# EAGLE design BLE -- HM-10 -- Breakout v1.0 (EAGLE 7.7.0)
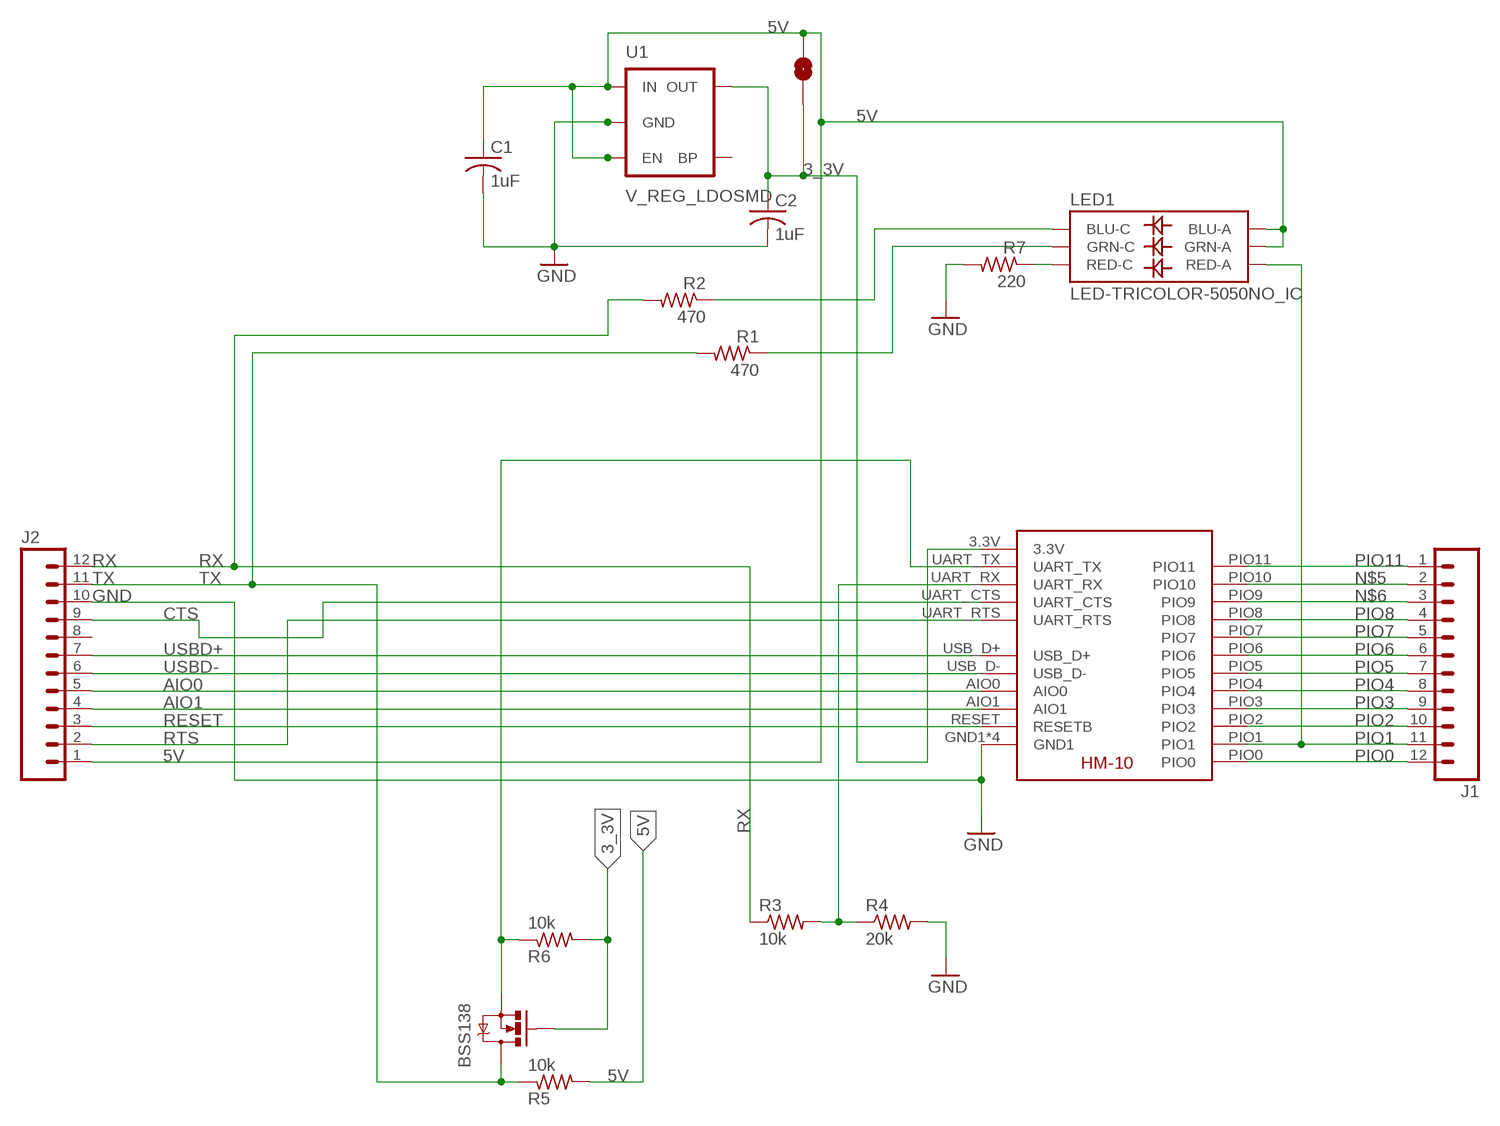
[diagram p0: schematic, sheet 1]

## Parts
BSS138  MOSFET-NCHANNELSMD  [SOT23-3]
C1  1uF  C-USC0805K  [C0805K]
C2  1uF  C-USC0805K  [C0805K]
J1  M12LOCK  [1X12_LOCK]
J2  M12LOCK  [1X12_LOCK]
LED1  LED-TRICOLOR-5050NO_IC  [LED-TRICOLOR-5050]
R1  470  R-US_M0805  [M0805]
R2  470  R-US_M0805  [M0805]
R3  10k  R-US_M0805  [M0805]
R4  20k  R-US_M0805  [M0805]
R5  10k  R-US_M0805  [M0805]
R6  10k  R-US_M0805  [M0805]
R7  220  R-US_M0805  [M0805]
SJ1  SOLDERJUMPERNO  [SJ_2S-NO]
U1  V_REG_LDOSMD  [SOT23-5]
U$1  BLE-HM-10  [BLE-HM-10]

## Nets
3_3V: BSS138.1(G) C2.1 R6.2 SJ1.1 U1.5(OUT) U$1.3.3V
5V: C1.1 J2.1 LED1.1(GRN-A) LED1.3(BLU-A) R5.2 SJ1.2 U1.1(IN) U1.3(EN)
AIO0: J2.5 U$1.AIO0
AIO1: J2.4 U$1.AIO1
CTS: J2.9 U$1.UART_CTS
GND: C1.2 C2.2 J2.10 R4.2 R7.2 U1.2(GND) U$1.GND1 U$1.GND2(GND1) U$1.GND3(GND1) U$1.GND4(GND1)
HMD_RX: R3.2 R4.1 U$1.UART_RX
N$2: LED1.5(RED-C) R7.1
N$3: LED1.4(BLU-C) R2.1
N$4: LED1.6(GRN-C) R1.1
N$5: J1.2 U$1.PIO10
N$6: J1.3 U$1.PIO9
PIO0: J1.12 U$1.PIO0
PIO1: J1.11 LED1.2(RED-A) U$1.PIO1
PIO2: J1.10 U$1.PIO2
PIO3: J1.9 U$1.PIO3
PIO4: J1.8 U$1.PIO4
PIO5: J1.7 U$1.PIO5
PIO6: J1.6 U$1.PIO6
PIO7: J1.5 U$1.PIO7
PIO8: J1.4 U$1.PIO8
PIO11: J1.1 U$1.PIO11
RESET: J2.3 U$1.RESET(RESETB)
RTS: J2.2 U$1.UART_RTS
RX: J2.12 R2.2 R3.1
TX: BSS138.2(S) BSS138.3(D) J2.11 R1.2 R5.1 R6.1 U$1.UART_TX
USBD+: J2.7 U$1.USB_D+
USBD-: J2.6 U$1.USB_D-
Unconnected: J2.8 U1.4(BP)

## Library data of the parts
BSS138 = SparkFun:MOSFET-NCHANNEL
C1 C2 = resistor:C-US: CAPACITOR, American symbol
J1 J2 = SparkFun-Connectors:M12: Header 12 Standard 12-pin 0.1" header. Use with straight break away headers (SKU : PRT-00116), right angle break away headers (PRT-00553), swiss pins (PRT-00743), machine pins (PRT-00117), and female headers (PRT-00115).
LED1 = SparkFun-LED:LED-TRICOLOR-5050; PROD_ID: DIO-10298
R1-R7 = resistor:R-US_: RESISTOR, American symbol
SJ1 = SparkFun:SOLDERJUMPER: Solder Jumper Standard SMD solder jumper. Used to automate production. Two varients : Normally Open and Normally Closed are the same, but have different paste layers. NC will have a large amount of paste and should jumper during reflow.
U1 = SparkFun:V_REG_LDO: Voltage Regulator LDO Standard 150mA LDO voltage regulator in SOT-23 layout. Micrel part MIC5205. BP (by-pass) pin is used to lower output noise with 470pF cap.
U$1 = Random parts:BLE-HM-10

## Board
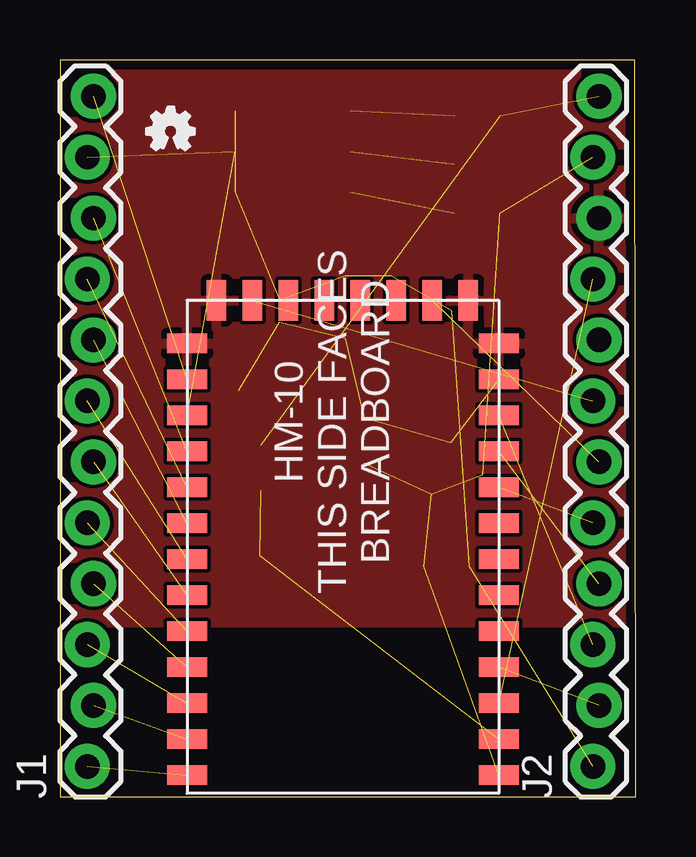
[diagram p1: board, top side]
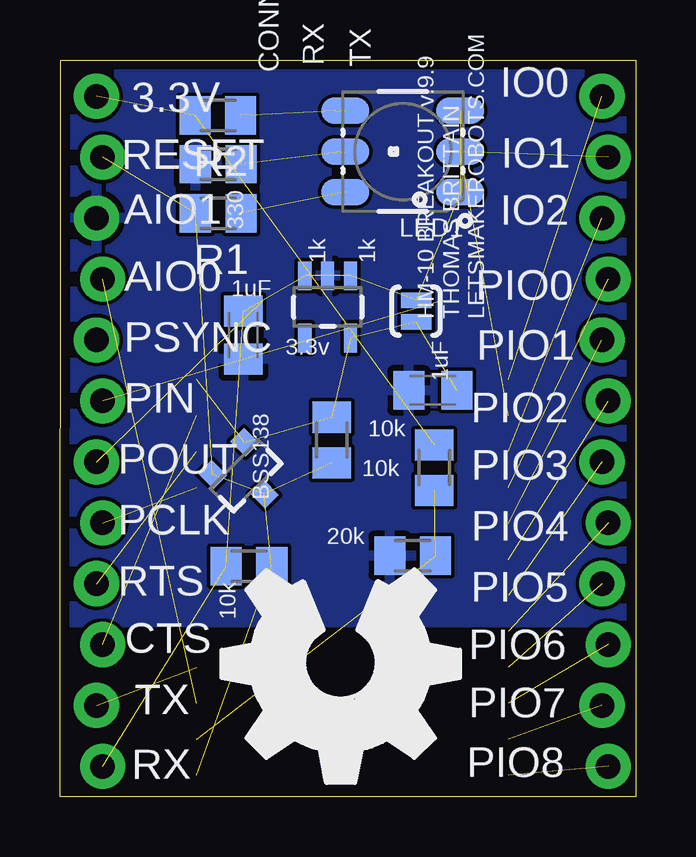
[diagram p2: board, bottom side, seen from below]

Size 24 x 30.72 mm. Coordinates in mm from the lower left corner, seen from the top.
Outline: 0,0 24,0 23.98,30.72 0,30.72 0,0
Copper layers (1*16): Top 0.0356mm / dielectric 1.5011mm / Bottom 0.0356mm
Design rules "LaenPCBOrder *": minimum track width 12mil, minimum drill 13mil, track to track 6mil, track to pad 6mil, pad to pad 6mil, via to via 6mil, smd to smd 6mil, copper to edge 15mil, drill to drill 6mil, minimum pad ring 7mil, minimum via ring 7mil, stop-mask expansion 4mil, vias tented up to drill 0.4mm, thermal gap 10mil

### Footprints (pad centres in the part's own frame; a part is rotated, then mirrored left to right if it is on the bottom)
SOT23-3 = smd 0.8 x 0.9: 1 -0.95,-1; 2 0.95,-1; 3 0,1.1
C0805K = smd 1.3 x 1.6: 1 -1,0; 2 1,0
1X12_LOCK = drill 1.016 pad 1.88: 1 0,0.127; 2 2.54,-0.127; 3 5.08,0.127; 4 7.62,-0.127; 5 10.16,0.127; 6 12.7,-0.127; 7 15.24,0.127; 8 17.78,-0.127; 9 20.32,0.127; 10 22.86,-0.127; 11 25.4,0.127; 12 27.94,-0.127
LED-TRICOLOR-5050 = smd 2 x 1.1: 1 -2.4,1.7; 2 -2.4,0; 3 -2.4,-1.7; 4 2.4,-1.7; 5 2.4,0; 6 2.4,1.7
M0805 = smd 1.3 x 1.6: 1 -0.95,0; 2 0.95,0
SJ_2S-NO = smd 0.635 x 1.27: 1 -0.45,0; 2 0.45,0
SOT23-5 = smd 0.55 x 1.2: 1 -0.95,-1.3; 2 0,-1.3; 3 0.95,-1.3; 4 0.95,1.3; 5 -0.95,1.3
BLE-HM-10 = smd 1.676 x 0.813: 3.3V 0,3.29; AIO0 0,7.79; AIO1 0,6.29; GND1 0,1.79; GND4 13,1.79; PCM_CLK 0,13.79; PCM_IN 0,10.79; PCM_OUT 0,12.29; PCM_SYNC 0,9.29; PIO0 13,3.29; PIO1 13,4.79; PIO2 13,6.29; PIO3 13,7.79; PIO4 13,9.29; PIO5 13,10.79; PIO6 13,12.29; PIO7 13,13.79; PIO8 13,15.29; PIO9 13,16.79; PIO10 13,18.29; PIO11 13,19.79; RESET 0,4.79; UART_CTS 0,16.79; UART_RTS 0,15.29; UART_RX 0,18.29; UART_TX 0,19.79 | smd 0.813 x 1.676: GND2 1.27,0; GND3 11.77,0; SPI_CLK 8.77,0; SPI_CSB 4.27,0; SPI_MISO 7.27,0; SPI_MOSI 5.77,0; USB_D+ 10.27,0; USB_D- 2.77,0

### Placement (x,y rotation side)
BSS138  16.26,13.41 225 bottom
C1  16.35,19.25 270 bottom
C2  8.45,16.95 180 bottom
J1  1.27,1.27 90 top
J2  22.35,1.27 90 top
LED1  9.71,26.91 180 bottom
R1  17.4,24.33 180 bottom
R2  17.41,28.41 180 bottom
R3  8.39,13.73 270 bottom
R4  9.29,10.06 180 bottom
R5  16.12,9.62 180 bottom
R6  12.67,14.88 90 bottom
R7  17.4,26.38 180 bottom
SJ1  9.15,20.25 90 bottom
U1  12.84,20.43 180 bottom
U$1  18.3,20.7 180 top
U$2  [OSHW_FILLX350_NOTEXT]  7.34,9.47 180 bottom
U$3  [OSHW_FILLX70_NOTEXT]  3.62,26.98 0 top

### Tracks (layer width: path | path; a pad name or v marks a point on that pad's centre or on a via)
3_3V  (5 unrouted)
5V  (7 unrouted)
AIO0  (1 unrouted)
AIO1  (1 unrouted)
CTS  (1 unrouted)
GND
  pour Bottom: -0.51,7.27 24.64,7.27 24.38,30.73 -0.76,30.73
  pour Top: -0.01,30.66 -0.1,7.28 23.4,7.28 23.49,30.66
HMD_RX  (2 unrouted)
N$2  (1 unrouted)
N$3  (1 unrouted)
N$4  (1 unrouted)
N$5  (1 unrouted)
N$6  (1 unrouted)
PIO0  (1 unrouted)
PIO1  (2 unrouted)
PIO2  (1 unrouted)
PIO3  (1 unrouted)
PIO4  (1 unrouted)
PIO5  (1 unrouted)
PIO6  (1 unrouted)
PIO7  (1 unrouted)
PIO8  (1 unrouted)
PIO11  (1 unrouted)
RESET  (1 unrouted)
RTS  (1 unrouted)
RX  (2 unrouted)
TX  (6 unrouted)
USBD+  (1 unrouted)
USBD-  (1 unrouted)

### Text on the board
tNames: HM-10 / THIS SIDE FACES / BREADBOARD
bNames: RX | TX | CONN | IO0 | 3.3V | IO1 | RESET | 330 | IO2 | AIO1 | 1k | 1k | PIO0 | 1uF | AIO0 | HM-10 BREAKOUT v.9.9 / THOMAS BRITTAIN / LETSMAKEROBOTS.COM | PSYNC | PIO1 | 3.3v | 1uF | PIO2 | PIN | 10k | 10k | PIO3 | POUT | BSS138 | PIO4 | 20k | PCLK | 10k | PIO5 | RTS | PIO6 | CTS | PIO7 | TX | PIO8 | RX